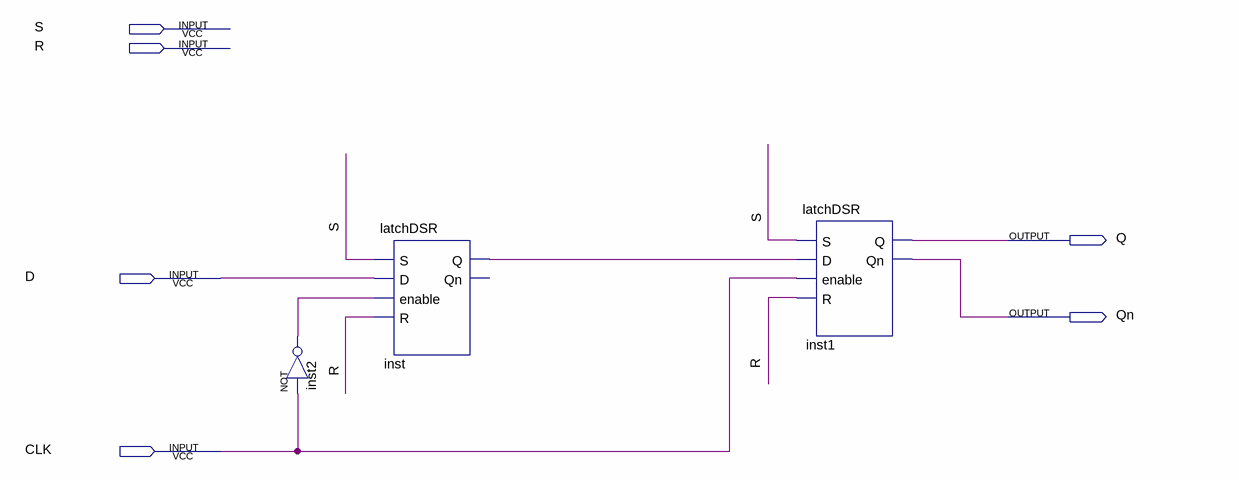
[diagram p0: schematic sheet]
// Quartus schematic dffrs.bdf as structural Verilog: 3 symbols, 6 pins
module dffrs (
  input  S,
  input  R,
  input  D,
  input  CLK,
  output Q,
  output Qn
);

  wire inst2_out, inst_q;

  not inst2 (inst2_out, CLK);
  latchDSR inst (.S(S), .D(D), .enable(inst2_out), .R(R), .Q(inst_q));  // open: Qn
  latchDSR inst1 (.S(S), .D(inst_q), .enable(CLK), .R(R), .Q(Q), .Qn(Qn));
endmodule
